# EAGLE schematic ULA (EAGLE 6.3)
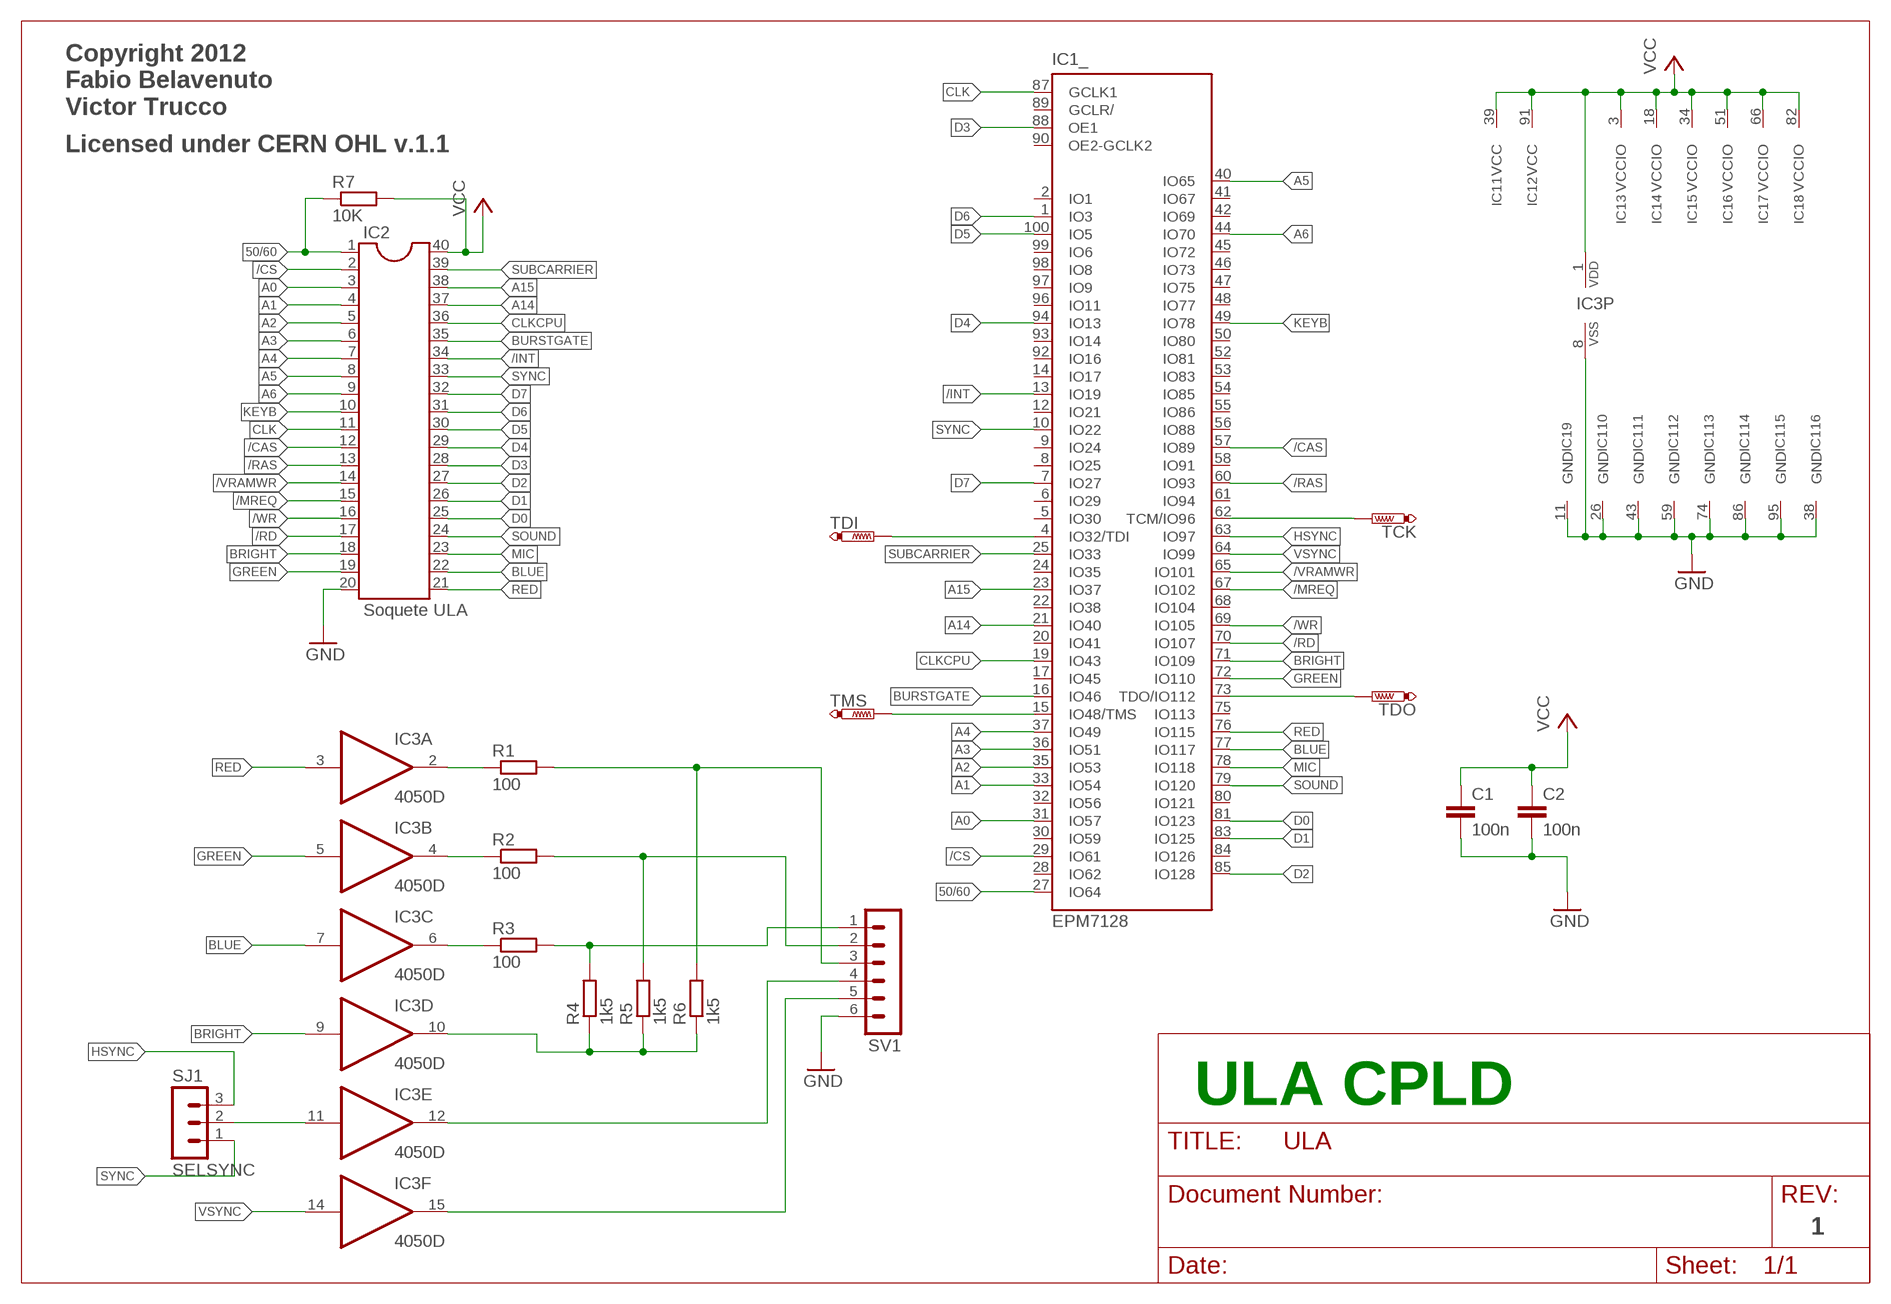
[diagram p0: schematic, sheet 1]

## Parts
C1  100n  C-EUC1206K  [C1206K]
C2  100n  C-EUC1206K  [C1206K]
IC1  EPM7128  EPM7128-T100  [TQFP100]
IC2  Soquete ULA  DIL40  [DIL40]
IC3  4050D  [SO16]
R1  100  R-EU_M0805  [M0805]
R2  100  R-EU_M0805  [M0805]
R3  100  R-EU_M0805  [M0805]
R4  1k5  R-EU_M0805  [M0805]
R5  1k5  R-EU_M0805  [M0805]
R6  1k5  R-EU_M0805  [M0805]
R7  10K  R-EU_M0805  [M0805]
SJ1  SELSYNC  MA03-1MA03-1-1  [MA03-1-1]
SV1  MA06-11  [MA06-1-1]
TCK  PTR1PAD1-10  [P1-10]
TDI  PTR1PAD1-10  [P1-10]
TDO  PTR1PAD1-10  [P1-10]
TMS  PTR1PAD1-10  [P1-10]

## Nets
50/60: IC1.27(_:IO64) IC2.1 R7.1
/CAS: IC1.57(_:IO89) IC2.12
/CS: IC1.29(_:IO61) IC2.2
/INT: IC1.13(_:IO19) IC2.34
/MREQ: IC1.67(_:IO102) IC2.15
/RAS: IC1.60(_:IO93) IC2.13
/RD: IC1.70(_:IO107) IC2.17
/VRAMWR: IC1.65(_:IO101) IC2.14
/WR: IC1.69(_:IO105) IC2.16
A0: IC1.31(_:IO57) IC2.3
A1: IC1.33(_:IO54) IC2.4
A2: IC1.35(_:IO53) IC2.5
A3: IC1.36(_:IO51) IC2.6
A4: IC1.37(_:IO49) IC2.7
A5: IC1.40(_:IO65) IC2.8
A6: IC1.44(_:IO70) IC2.9
A14: IC1.21(_:IO40) IC2.37
A15: IC1.23(_:IO37) IC2.38
BLUE: IC1.77(_:IO117) IC2.22 IC3.7(C:I)
BRIGHT: IC1.71(_:IO109) IC2.18 IC3.9(D:I)
BURSTGATE: IC1.16(_:IO46) IC2.35
CLK: IC1.87(_:GCLK1) IC2.11
CLKCPU: IC1.19(_:IO43) IC2.36
D0: IC1.81(_:IO123) IC2.25
D1: IC1.83(_:IO125) IC2.26
D2: IC1.85(_:IO128) IC2.27
D3: IC1.88(_:OE1) IC2.28
D4: IC1.94(_:IO13) IC2.29
D5: IC1.100(_:IO5) IC2.30
D6: IC1.1(_:IO3) IC2.31
D7: IC1.7(_:IO27) IC2.32
GND [Power]: C1.2 C2.2 IC1.11(9:GND) IC1.26(10:GND) IC1.38(16:GND) IC1.43(11:GND) IC1.59(12:GND) IC1.74(13:GND) IC1.86(14:GND) IC1.95(15:GND) IC2.20 IC3.8(P:VSS) SV1.6
GREEN: IC1.72(_:IO110) IC2.19 IC3.5(B:I)
HSYNC: IC1.63(_:IO97) SJ1.3
KEYB: IC1.49(_:IO78) IC2.10
MIC: IC1.78(_:IO118) IC2.23
N$1: IC3.2(A:O) R1.1
N$2: IC3.4(B:O) R2.1
N$3: IC3.6(C:O) R3.1
N$4: R3.2 R4.2 SV1.1
N$5: R2.2 R5.2 SV1.2
N$6: IC1.4(_:IO32/TDI) TDI.TP
N$7: IC1.15(_:IO48/TMS) TMS.TP
N$8: IC1.73(_:TDO/IO112) TDO.TP
N$9: IC1.62(_:TCM/IO96) TCK.TP
N$10: R1.2 R6.2 SV1.3
N$11: IC3.10(D:O) R4.1 R5.1 R6.1
N$12: IC3.11(E:I) SJ1.2
N$13: IC3.12(E:O) SV1.4
N$14: IC3.15(F:O) SV1.5
RED: IC1.76(_:IO115) IC2.21 IC3.3(A:I)
SOUND: IC1.79(_:IO120) IC2.24
SUBCARRIER: IC1.25(_:IO33) IC2.39
SYNC: IC1.10(_:IO22) IC2.33 SJ1.1
VCC [Power]: C1.1 C2.1 IC1.3(3:VCCIO) IC1.18(4:VCCIO) IC1.34(5:VCCIO) IC1.39(1:VCC) IC1.51(6:VCCIO) IC1.66(7:VCCIO) IC1.82(8:VCCIO) IC1.91(2:VCC) IC2.40 IC3.1(P:VDD) R7.2
VSYNC: IC1.64(_:IO99) IC3.14(F:I)
Unconnected: IC1.2(_:IO1) IC1.5(_:IO30) IC1.6(_:IO29) IC1.8(_:IO25) IC1.9(_:IO24) IC1.12(_:IO21) IC1.14(_:IO17) IC1.17(_:IO45) IC1.20(_:IO41) IC1.22(_:IO38) IC1.24(_:IO35) IC1.28(_:IO62) IC1.30(_:IO59) IC1.32(_:IO56) IC1.41(_:IO67) IC1.42(_:IO69) IC1.45(_:IO72) IC1.46(_:IO73) IC1.47(_:IO75) IC1.48(_:IO77) IC1.50(_:IO80) IC1.52(_:IO81) IC1.53(_:IO83) IC1.54(_:IO85) IC1.55(_:IO86) IC1.56(_:IO88) IC1.58(_:IO91) IC1.61(_:IO94) IC1.68(_:IO104) IC1.75(_:IO113) IC1.80(_:IO121) IC1.84(_:IO126) IC1.89(_:GCLR/) IC1.90(_:OE2-GCLK2) IC1.92(_:IO16) IC1.93(_:IO14) IC1.96(_:IO11) IC1.97(_:IO9) IC1.98(_:IO8) IC1.99(_:IO6)

## Notes on the sheet
- Copyright 2012
  Fabio Belavenuto
  Victor Trucco
- Licensed under CERN OHL v.1.1
- ULA CPLD
- 1

## Library data of the parts
C1 C2 = rcl2:C-EU: CAPACITOR, European symbol
IC1 = altera2:EPM7128-?100: EPM70128 MAX 7000 family; MPN: EPM7128STC100-7N; OC_FARNELL: 1549427; OC_NEWARK: 51R9778
IC2 = soquete_dip40:DIL40: Dual In Line
IC3 = 40xx:4050: Hex non-inverting BUFFER
R1-R7 = rcl:R-EU_: RESISTOR, European symbol
SJ1 = con-lstb2:MA03-1: PIN HEADER
SV1 = con-lstb2:MA06-1: PIN HEADER
TCK TDI TDO TMS = testpad2:PTR1: TEST PIN

## Net classes
0 default: width 0.254 mm, drill 0.584 mm, clearance 0.203 mm
1 Power: width 0.406 mm, drill 0.584 mm, clearance 0.203 mm